# EasyEDA Pro project BLDC_Driverv3.eprj, board PCB1
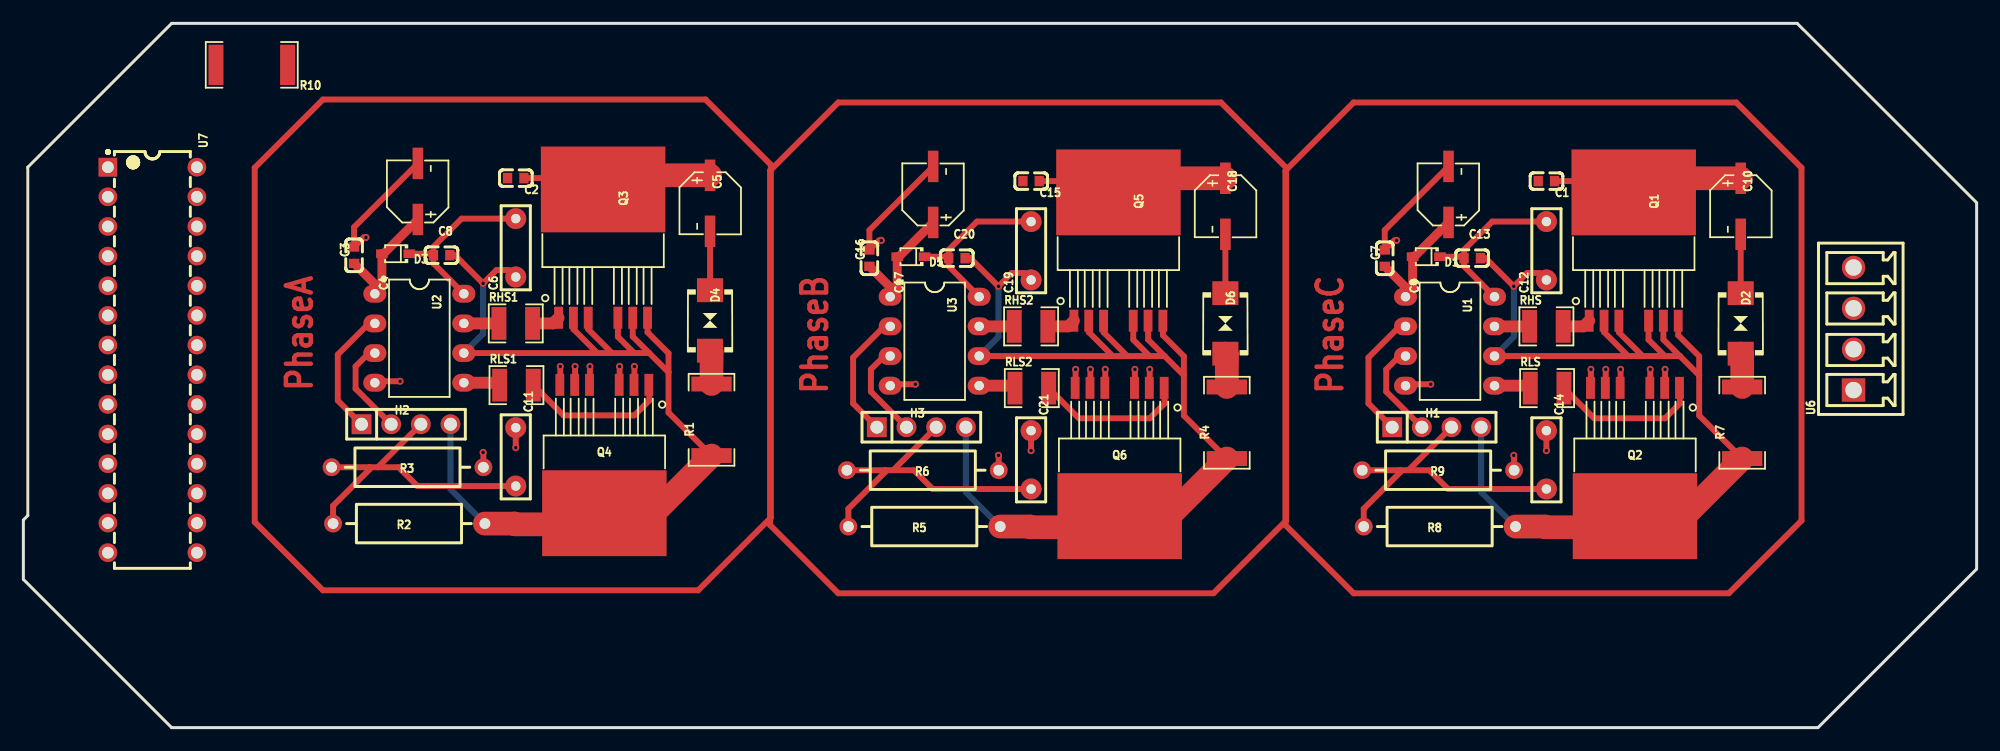
[diagram p6: board, top side]
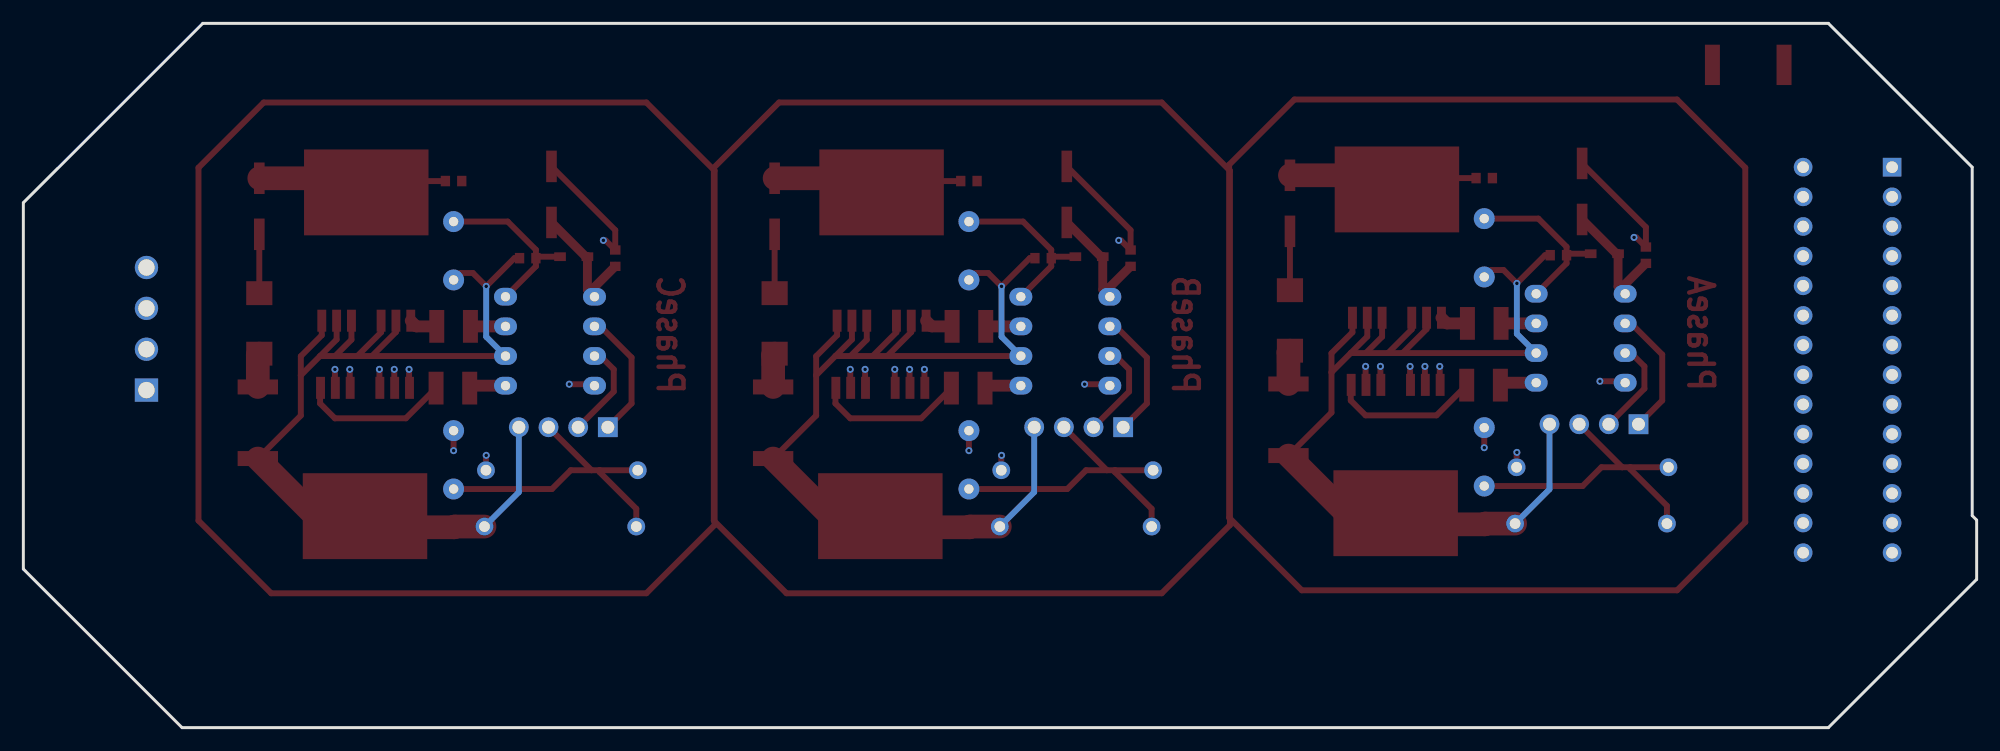
[diagram p7: board, bottom side, seen from below]

Outline 167.26 x 60.33 mm; copper layers: Top Layer, Bottom Layer. Coordinates in mm from the lower left corner of the outline.
Outline path: 0,17.78 0,12.7 12.7,0 153.67,0 167.26,13.59 167.26,44.96 151.89,60.33 12.7,60.33 0.38,48.01 0.38,18.16 0,17.78
Stack: Top Layer 0.035mm / Dielectric1 1.51mm FR4 er 4.5 / Bottom Layer 0.035mm

## Design rules (mm)
template: JLCPCB Capability(Two Layers Board)
spacing copperThickness1oz (default): track to track 0.102, other pairs 0.152 to 0.3
spacing copperThickness2oz: track to track 0.203, other pairs 0.152 to 0.3
track width copperThickness1oz (default): min 0.127, default 0.254, max 2.54
track width copperThickness2oz: min 0.203, default 0.254, max 2.54
differential pair differentialPair (default): width min 0.127, default 0.254, max 2.54; gap min 0.152, default 0.152
via viaSize (default): diameter min 0.5, default 0.61, max 10; hole min 0.3, default 0.305, max 6.3

## Placement (name value [footprint] x y rotation side)
C1  100nF  [C0603]  130.42 46.82 180 top
C2  100nF  [C0603]  42.16 47.07 180 top
C3  100nF  [C0603]  28.32 40.47 90 top
C4  10uF  [CAP-SMD_BD5.0-L5.3-W5.3-LS6.3-FD]  33.78 45.93 90 top
C5  10uF  [CAP-SMD_BD5.0-L5.3-W5.3-LS6.3-FD]  58.8 44.91 270 top
C6  1uF  [CAP-TH_L7.2-W2.5-P5.00-D0.6]  42.16 41.1 90 top
C7  100nF  [C0603]  116.58 40.21 90 top
C8  100nF  [C0603]  35.81 40.47 0 top
C9  10uF  [CAP-SMD_BD5.0-L5.3-W5.3-LS6.3-FD]  122.04 45.67 90 top
C10  10uF  [CAP-SMD_BD5.0-L5.3-W5.3-LS6.3-FD]  147.06 44.66 270 top
C11  1uF  [CAP-TH_L7.2-W2.5-P5.00-D0.6]  42.16 23.19 270 top
C12  1uF  [CAP-TH_L7.2-W2.5-P5.00-D0.6]  130.42 40.85 90 top
C13  100nF  [C0603]  124.07 40.21 0 top
C14  1uF  [CAP-TH_L7.2-W2.5-P5.00-D0.6]  130.42 22.94 270 top
C15  100nF  [C0603]  86.29 46.82 180 top
C16  100nF  [C0603]  72.45 40.21 90 top
C17  10uF  [CAP-SMD_BD5.0-L5.3-W5.3-LS6.3-FD]  77.91 45.67 90 top
C18  10uF  [CAP-SMD_BD5.0-L5.3-W5.3-LS6.3-FD]  102.93 44.66 270 top
C19  1uF  [CAP-TH_L7.2-W2.5-P5.00-D0.6]  86.29 40.85 90 top
C20  100nF  [C0603]  79.94 40.21 0 top
C21  1uF  [CAP-TH_L7.2-W2.5-P5.00-D0.6]  86.29 22.94 270 top
D1  1N5819WS  [SOD-323_L1.8-W1.3-LS2.5-RD]  120.13 40.34 180 top
D2  P6SMB6.8CA/TR13  [SMB_L4.6-W3.6-LS5.3-BI]  147.06 34.62 270 top
D3  1N5819WS  [SOD-323_L1.8-W1.3-LS2.5-RD]  31.88 40.59 180 top
D4  P6SMB6.8CA/TR13  [SMB_L4.6-W3.6-LS5.3-BI]  58.8 34.88 270 top
D5  1N5819WS  [SOD-323_L1.8-W1.3-LS2.5-RD]  76 40.34 180 top
D6  P6SMB6.8CA/TR13  [SMB_L4.6-W3.6-LS5.3-BI]  102.93 34.62 270 top
H1  -  [HDR-TH_4P-P2.54-V-M]  121.02 25.73 0 top
H2  -  [HDR-TH_4P-P2.54-V-M]  32.77 25.99 0 top
H3  -  [HDR-TH_4P-P2.54-V-M]  76.89 25.73 0 top
Q1  IRF2804STRL7PP  [D2PAK-7_L10.6-W9.6-P1.27-LS15.9-BR]  137.89 40.35 270 top
Q2  IRF2804STRL7PP  [D2PAK-7_L10.6-W9.6-P1.27-LS15.9-BR]  138 23.61 90 top
Q3  IRF2804STRL7PP  [D2PAK-7_L10.6-W9.6-P1.27-LS15.9-BR]  49.64 40.6 270 top
Q4  IRF2804STRL7PP  [D2PAK-7_L10.6-W9.6-P1.27-LS15.9-BR]  49.75 23.86 90 top
Q5  IRF2804STRL7PP  [D2PAK-7_L10.6-W9.6-P1.27-LS15.9-BR]  93.77 40.35 270 top
Q6  IRF2804STRL7PP  [D2PAK-7_L10.6-W9.6-P1.27-LS15.9-BR]  93.88 23.61 90 top
R1  5mΩ  [R2512]  58.93 26.37 90 top
R2  10kΩ  [RES-TH_BD3.3-L9.0-P13.00-D0.6]  33.02 17.48 0 top
R3  10kΩ  [RES-TH_BD3.3-L9.0-P13.00-D0.6]  32.89 22.31 180 top
R4  5mΩ  [R2512]  103.06 26.12 90 top
R5  10kΩ  [RES-TH_BD3.3-L9.0-P13.00-D0.6]  77.15 17.23 0 top
R6  10kΩ  [RES-TH_BD3.3-L9.0-P13.00-D0.6]  77.02 22.05 180 top
R7  5mΩ  [R2512]  147.18 26.12 90 top
R8  10kΩ  [RES-TH_BD3.3-L9.0-P13.00-D0.6]  121.27 17.23 0 top
R9  10kΩ  [RES-TH_BD3.3-L9.0-P13.00-D0.6]  121.15 22.05 180 top
R10  5mΩ  [R2512]  19.56 56.77 180 top
RHS  10  [R1210]  130.42 34.37 0 top
RHS1  10  [R1210]  42.16 34.62 0 top
RHS2  10  [R1210]  86.29 34.37 0 top
RLS  10  [R1210]  130.48 29.08 0 top
RLS1  10  [R1210]  42.22 29.34 0 top
RLS2  10  [R1210]  86.35 29.08 0 top
U1  IR2104PBF  [DIP-8_L9.9-W6.6-P2.54-LS7.62-BL]  122.16 33.1 270 top
U2  IR2104PBF  [DIP-8_L9.9-W6.6-P2.54-LS7.62-BL]  33.91 33.35 270 top
U3  IR2104PBF  [DIP-8_L9.9-W6.6-P2.54-LS7.62-BL]  78.04 33.1 270 top
U6  15ETYVC-3.5-04P-14-00  [CONN-TH_4P-P3.50_TOPONELEC_15ETYVC-3.5-04P-14-00AH]  156.72 34.16 90 top
U7  ATMEGA328-PU  [DIP-28_L35.0-W6.5-P2.54-LS7.6-BL]  11.05 31.5 270 top

## Footprints (pads in the part's own frame, mm; a bottom-side part is the same pattern mirrored in y, then rotated)
C0603
  rect 0.8x0.9 smd: 1(-0.7,0) 2(0.7,0)
CAP-SMD_BD5.0-L5.3-W5.3-LS6.3-FD
  rect 2.7x0.91 smd: 1(-2.4,0) 2(2.4,0)
CAP-TH_L7.2-W2.5-P5.00-D0.6
  round 1.8 hole 0.8: 1(-2.499,0) 2(2.499,0)
CONN-TH_4P-P3.50_TOPONELEC_15ETYVC-3.5-04P-14-00AH
  rect 2x2 hole 1.4: 1(-5.25,0)
  round 2 hole 1.4: 2(-1.75,0) 3(1.75,0) 4(5.25,0)
D2PAK-7_L10.6-W9.6-P1.27-LS15.9-BR
  rect 1.887x0.762 smd: 1(5.495,-3.81) 2(5.495,-2.54) 3(5.495,-1.27) 5(5.495,1.27) 6(5.495,2.54) 7(5.495,3.81)
  rect 7.356x10.66 smd: 4(-5.495,0)
DIP-8_L9.9-W6.6-P2.54-LS7.62-BL
  oval 1.524x1.97 hole 0.8: 1(-3.81,-3.81) 2(-1.27,-3.81) 3(1.27,-3.81) 4(3.81,-3.81) 5(3.81,3.81) 6(1.27,3.81) 7(-1.27,3.81) 8(-3.81,3.81)
DIP-28_L35.0-W6.5-P2.54-LS7.6-BL
  rect 1.6x1.6 hole 1: 1(-16.51,-3.81)
  round 1.6 hole 1: 2(-13.97,-3.81) 3(-11.43,-3.81) 4(-8.89,-3.81) 5(-6.35,-3.81) 6(-3.81,-3.81) 7(-1.27,-3.81) 8(1.27,-3.81) 9(3.81,-3.81) 10(6.35,-3.81) 11(8.89,-3.81) 12(11.43,-3.81) 13(13.97,-3.81) 14(16.51,-3.81) 15(16.51,3.81) 16(13.97,3.81) 17(11.43,3.81) 18(8.89,3.81) 19(6.35,3.81) 20(3.81,3.81) 21(1.27,3.81) 22(-1.27,3.81) 23(-3.81,3.81) 24(-6.35,3.81) 25(-8.89,3.81) 26(-11.43,3.81) 27(-13.97,3.81) 28(-16.51,3.81)
HDR-TH_4P-P2.54-V-M
  rect 1.7x1.7 hole 1.1: 1(-3.81,0)
  round 1.7 hole 1.1: 2(-1.27,0) 3(1.27,0) 4(3.81,0)
R1210
  rect 1.282x2.808 smd: 1(-1.441,0) 2(1.441,0)
R2512
  rect 1.282x3.456 smd: 1(-3.067,0) 2(3.067,0)
RES-TH_BD3.3-L9.0-P13.00-D0.6
  round 1.524 hole 0.914: 1(-6.5,0) 2(6.5,0)
SMB_L4.6-W3.6-LS5.3-BI
  rect 2.047x2.241 smd: 1(-2.591,0) 2(2.591,0)
SOD-323_L1.8-W1.3-LS2.5-RD
  rect 1x0.75 smd: 1(-1.173,0) 2(1.173,0)

## Nets
GND: C1.2 C2.2 C3.2 C4.2 C5.2 C7.2 C9.2 C10.2 C11.1 C14.1 C15.2 C16.2 C17.2 C18.2 C21.1 D2.1 D4.1 D6.1 Q2.2 Q2.3 Q2.5 Q2.6 Q2.7 Q4.2 Q4.3 Q4.5 Q4.6 Q4.7 Q6.2 Q6.3 Q6.5 Q6.6 Q6.7 R3.1 R6.1 R9.1 U1.4 U2.4 U3.4 U6.4
VCC: C3.1 C4.1 C7.1 C9.1 C16.1 C17.1 D1.2 D3.2 D5.2 R10.2 U1.1 U2.1 U3.1
$1I57/HI_IN: H1.1 U1.2
$1I57/ISENSE: C12.1 C13.2 H1.4 Q1.2 Q1.3 Q1.5 Q1.6 Q1.7 Q2.4 R7.1 R8.2 U1.6
$1I57/PHASE_OUT: D2.2 R7.2
$1I57/SD#: H1.2 U1.3
$1I57/VSENSE: C14.2 H1.3 R8.1 R9.2
$1I78/HI_IN: H2.1 U2.2
$1I78/ISENSE: C6.1 C8.2 H2.4 Q3.2 Q3.3 Q3.5 Q3.6 Q3.7 Q4.4 R1.1 R2.2 U2.6
$1I78/PHASE_OUT: D4.2 R1.2
$1I78/SD#: H2.2 U2.3
$1I78/VSENSE: C11.2 H2.3 R2.1 R3.2
$1I99/HI_IN: H3.1 U3.2
$1I99/ISENSE: C19.1 C20.2 H3.4 Q5.2 Q5.3 Q5.5 Q5.6 Q5.7 Q6.4 R4.1 R5.2 U3.6
$1I99/PHASE_OUT: D6.2 R4.2
$1I99/SD#: H3.2 U3.3
$1I99/VSENSE: C21.2 H3.3 R5.1 R6.2
$1I57/$1N697: RHS.1 U1.7
$1I57/$1N698: Q1.1 RHS.2
$1I57/$1N699: RLS.1 U1.5
$1I57/$1N700: Q2.1 RLS.2
$1I57/$1N2600: C12.2 C13.1 D1.1 U1.8
$1I78/$1N697: RHS1.1 U2.7
$1I78/$1N698: Q3.1 RHS1.2
$1I78/$1N699: RLS1.1 U2.5
$1I78/$1N700: Q4.1 RLS1.2
$1I78/$1N2600: C6.2 C8.1 D3.1 U2.8
$1I99/$1N697: RHS2.1 U3.7
$1I99/$1N698: Q5.1 RHS2.2
$1I99/$1N699: RLS2.1 U3.5
$1I99/$1N700: Q6.1 RLS2.2
$1I99/$1N2600: C19.2 C20.1 D5.1 U3.8
$1N1045: C1.1 C2.1 C5.1 C10.1 C15.1 C18.1 Q1.4 Q3.4 Q5.4 R10.1

Pads without a net: U6 1 2 3; U7 1 2 3 4 5 6 7 8 9 10 11 12 13 14 15 16 17 18 19 20 21 22 23 24 25 26 27 28

## Via types
v1: diameter 0.61, hole 0.305, Top Layer to Bottom Layer, 30 vias

## Routing (per net, layer and track width the routed paths; a pad name or vN(x,y) marks a point on that pad's centre or on a via; arc(x,y) is an arc through that point)
GND: length 87
  Top Layer w0.508: v1(90.1,30.69) 90.1,29.14 Q6.7 ; v1(86.29,23.73) C21.1 ; R9.1 127.65,23.3 v1(127.62,23.32) ; Q4.2 52.32,29.39 v1(52.32,30.94) ; v1(117.59,41.74) 117.4,41.74 C7.2 116.58,42.61 C9.2 ; D6.1 C18.2 ; v1(95.18,30.69) 95.18,29.14 Q6.3 ; v1(51.05,30.94) 51.05,29.39 Q4.3 ; Q6.6 91.37,29.14 v1(91.37,30.69) ; C4.2 28.32,42.87 C3.2 29.15,41.99 v1(29.34,41.99) ; Q2.7 134.23,29.14 v1(134.23,30.69) ; D2.1 C10.2 ; D4.1 C5.2 ; v1(139.31,30.69) 139.31,29.14 Q2.3 ; v1(32.26,29.67) 30.23,29.67 U2.4 ; v1(73.46,41.74) 73.27,41.74 C16.2 72.45,42.61 C17.2 ; v1(96.45,30.69) 96.45,29.14 Q6.2 ; v1(136.77,30.69) 136.77,29.14 Q2.5 ; v1(92.64,30.69) 92.64,29.14 Q6.5 ; v1(47.24,30.94) 47.24,29.39 Q4.6 ; U1.4 118.48,29.42 v1(120.51,29.42) ; R3.1 39.39,23.55 v1(39.37,23.58) ; Q2.6 135.5,29.14 v1(135.5,30.69) ; v1(48.51,30.94) 48.51,29.39 Q4.5 ; v1(76.38,29.42) 74.35,29.42 U3.4 ; v1(45.97,30.94) 45.97,29.39 Q4.7 ; v1(130.42,23.73) C14.1 ; v1(42.16,23.98) C11.1 ; R6.1 83.52,23.3 v1(83.5,23.32) ; Q2.2 140.58,29.14 v1(140.58,30.69)
VCC: length 33.9
  Top Layer w0.762: C9.1 119.1,40.34 D1.2 118.96,37.52 U1.1 118.35,37.73 C7.1 ; C17.1 74.97,40.34 D5.2 74.83,37.52 U3.1 74.23,37.73 C16.1 ; C3.1 30.1,37.99 30.1,37.16 30.7,37.77 D3.2 30.85,40.59 C4.1
$1I57/HI_IN: length 11.1
  Top Layer w0.508: U1.2 117.85,34.37 115.18,31.7 115.18,27.77 H1.1
$1I57/ISENSE: length 93.4
  Top Layer w0.508: 138.66,31.83 136.62,33.86 136.62,34.85 ; 138.66,31.83 140.56,31.83 ; 138.66,31.83 137.41,31.83 ; Q1.7 141.7,33.61 143.5,31.81 143.5,30.18 ; C12.1 129.82,38.94 128.77,38.94 v1(127.62,37.8) 125.21,40.21 C13.2 ; 140.56,31.83 141.85,31.83 ; 140.56,31.83 139.16,33.23 Q1.5 ; 143.5,30.18 141.85,31.83 ; 143.5,30.18 143.5,26.73 R7.1 147.18,23.56 ; Q1.6 140.44,33.24 141.85,31.83 ; U1.6 137.41,31.83 ; 137.41,31.83 135.35,33.88 Q1.2
  Top Layer w2.032: R8.2 130.31,17.23 130.38,17.16 137.05,17.16 Q2.4 142.25,18.11 R7.1
  Bottom Layer w0.508: v1(127.62,37.8) 127.62,33.48 U1.6 ; H1.4 124.83,20.17 R8.2
$1I57/PHASE_OUT: length 2.9
  Top Layer w2.032: R7.2 147.18,31.91 D2.2
$1I57/SD#: length 8.3
  Top Layer w0.508: H1.2 116.7,28.78 116.7,30.69 117.85,31.83 U1.3
$1I57/VSENSE: length 27.3
  Top Layer w0.508: 118.61,22.05 H1.3 ; 118.61,22.05 117.91,22.05 ; 118.61,22.05 120.39,22.05 122,20.44 C14.2 ; 114.77,17.73 114.77,18.75 117.91,21.89 117.91,22.05 ; 117.91,22.05 R9.2
$1I78/HI_IN: length 11.1
  Top Layer w0.508: H2.1 26.92,28.02 26.92,31.96 29.59,34.62 U2.2
$1I78/ISENSE: length 93.4
  Top Layer w0.508: C8.2 36.96,40.47 v1(39.37,38.05) 40.51,39.2 41.57,39.2 C6.1 ; 48.37,35.11 48.37,34.12 50.4,32.08 ; 37.72,32.08 49.15,32.08 ; 49.15,32.08 50.4,32.08 ; 49.15,32.08 47.1,34.14 47.1,35.11 ; 53.45,35.11 53.45,33.86 55.24,32.07 55.24,30.43 ; 52.18,35.11 52.18,33.5 53.59,32.08 ; 52.31,32.08 53.59,32.08 ; 52.31,32.08 50.91,33.48 50.91,35.11 ; 52.31,32.08 50.4,32.08 ; 53.59,32.08 55.24,30.43 ; 55.24,30.43 55.24,26.99 R1.1 58.93,23.81
  Top Layer w2.032: R2.2 42.06,17.48 42.12,17.42 48.8,17.42 Q4.4 53.99,18.37 R1.1
  Bottom Layer w0.508: H2.4 36.58,20.42 R2.2 ; 37.72,32.08 39.37,33.74 v1(39.37,38.05)
$1I78/PHASE_OUT: length 2.9
  Top Layer w2.032: R1.2 58.93,32.16 D4.2
$1I78/SD#: length 8.3
  Top Layer w0.508: H2.2 28.45,29.04 28.45,30.94 29.59,32.08 30.1,32.08
$1I78/VSENSE: length 27.3
  Top Layer w0.508: 30.35,22.31 H2.3 ; 30.35,22.31 29.66,22.31 ; 30.35,22.31 32.13,22.31 33.74,20.69 C11.2 ; R3.2 29.66,22.31 ; 29.66,22.31 29.66,22.14 26.52,19 26.52,17.99
$1I99/HI_IN: length 11.1
  Top Layer w0.508: H3.1 71.05,27.77 71.05,31.7 73.72,34.37 U3.2
$1I99/ISENSE: length 93.4
  Top Layer w0.508: Q5.3 92.5,33.86 94.53,31.83 ; 93.28,31.83 91.23,33.88 Q5.2 ; 93.28,31.83 94.53,31.83 ; 93.28,31.83 U3.6 ; Q5.5 95.04,33.23 96.44,31.83 ; 99.37,30.18 99.37,31.81 97.58,33.61 Q5.7 ; 99.37,30.18 97.72,31.83 ; 99.37,30.18 99.37,26.73 R4.1 103.06,23.56 ; 96.44,31.83 97.72,31.83 ; 96.44,31.83 94.53,31.83 ; C20.2 81.08,40.21 v1(83.5,37.8) 84.64,38.94 85.7,38.94 C19.1 ; 97.72,31.83 96.31,33.24 Q5.6
  Top Layer w2.032: R4.1 98.12,18.11 Q6.4 92.92,17.16 86.25,17.16 86.19,17.23 R5.2
  Bottom Layer w0.508: v1(83.5,37.8) 83.5,33.48 U3.6 ; H3.4 80.7,20.17 R5.2
$1I99/PHASE_OUT: length 2.9
  Top Layer w2.032: D6.2 103.06,31.91 R4.2
$1I99/SD#: length 8.3
  Top Layer w0.508: H3.2 72.57,28.78 72.57,30.69 73.72,31.83 U3.3
$1I99/VSENSE: length 27.3
  Top Layer w0.508: 70.65,17.73 70.65,18.75 73.79,21.89 73.79,22.05 ; 73.79,22.05 74.48,22.05 ; 73.79,22.05 R6.2 ; C21.2 77.87,20.44 76.26,22.05 74.48,22.05 ; 74.48,22.05 78.16,25.73
$1I57/$1N697: length 3
  Top Layer w1.016: U1.7 RHS.1
$1I57/$1N698: length 2.4
  Top Layer w1.016: Q1.1 133.6,34.37 RHS.2
$1I57/$1N699: length 3.1
  Top Layer w1.016: RLS.1 128.83,29.29 U1.5
$1I57/$1N700: length 12.9
  Top Layer w0.508: Q2.1 141.85,29.07 141.85,27.77 140.58,26.5 134.51,26.5 RLS.2
$1I57/$1N2600: length 15.3
  Top Layer w0.508: D1.1 123.24,40.34 C13.1 ; C13.1 123.37,40.93 125.78,43.35 C12.2 ; C13.1 123.37,39.52 U1.8
$1I78/$1N697: length 3
  Top Layer w1.016: U2.7 RHS1.1
$1I78/$1N698: length 2.4
  Top Layer w1.016: RHS1.2 45.35,34.62 45.83,35.11
$1I78/$1N699: length 3.1
  Top Layer w1.016: U2.5 40.58,29.54 40.78,29.34
$1I78/$1N700: length 12.9
  Top Layer w0.508: RLS1.2 46.25,26.75 52.32,26.75 53.59,28.02 53.59,29.32 Q4.1
$1I78/$1N2600: length 15.3
  Top Layer w0.508: C8.1 35.11,41.18 37.53,43.6 C6.2 ; C8.1 34.99,40.59 D3.1 ; C8.1 35.11,39.77 37.72,37.16
$1I99/$1N697: length 3
  Top Layer w1.016: U3.7 RHS2.1
$1I99/$1N698: length 2.4
  Top Layer w1.016: RHS2.2 89.47,34.37 Q5.1
$1I99/$1N699: length 3.2
  Top Layer w1.016: RLS2.1 84.7,29.29 U3.5
$1I99/$1N700: length 12.9
  Top Layer w0.508: RLS2.2 90.38,26.5 96.45,26.5 97.72,27.77 97.72,29.07 Q6.1
$1I99/$1N2600: length 15.3
  Top Layer w0.508: C20.1 79.24,40.93 81.66,43.35 C19.2 ; C20.1 79.11,40.34 77.18,40.34 ; C20.1 79.24,39.52 U3.8
$1N1045: length 50.5
  Top Layer w0.508: C1.1 136.92,46.82 Q1.4 ; C15.1 92.8,46.82 Q5.4 ; Q3.4 48.67,47.07 C2.1
  Top Layer w2.032: Q1.4 139.11,47.06 C10.1 ; Q3.4 50.85,47.31 C5.1 ; Q5.4 94.98,47.06 C18.1

## Text on the board
Top Layer: PhaseA | PhaseB | PhaseC
